# Altium schematic sheet Alcohol Detectie.SchDoc
size A4; SheetNumber: 1; SheetTotal: 1
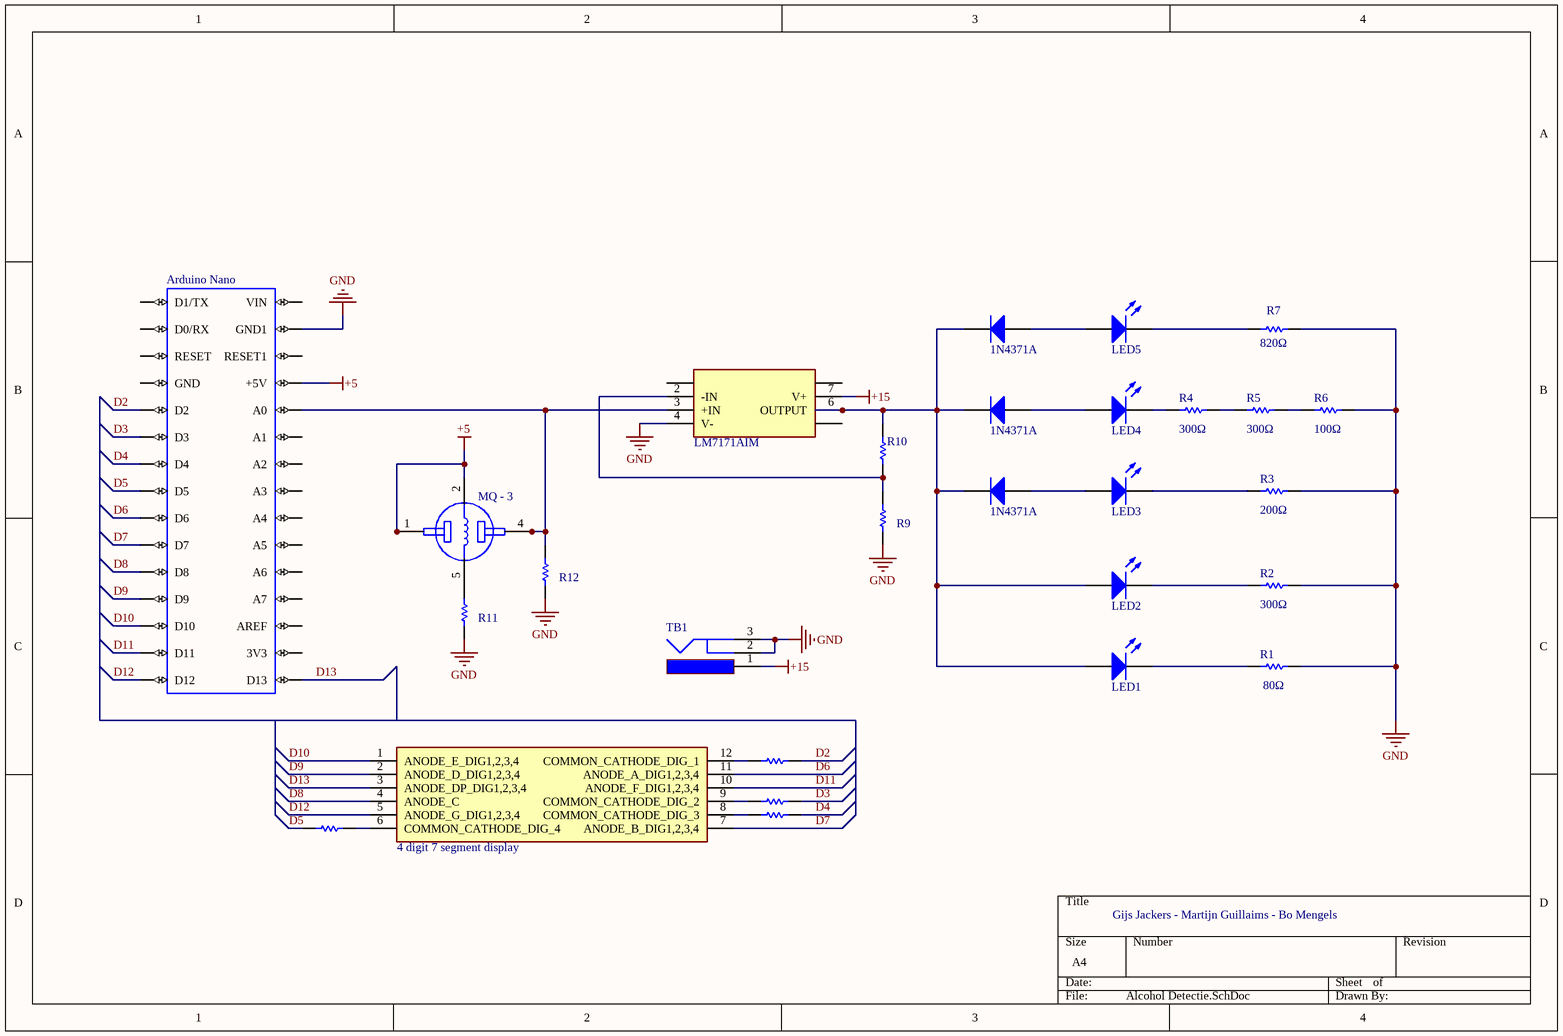
[diagram p0: Alcohol Detectie.SchDoc]

## Parts
4_digit_7_segment_display  CC56-12SRWA  [CC5612SRWA]  (value not drawn)
Arduino_Nano  ARDUINONANO  [PDIP-32]  (value not drawn)
COMPERATOR  LM7171AIM  [SOIC127P600X175-8N]
D1  1N4371A  [DO-35]
D2  1N4371A  [DO-35]
D3  1N4371A  [DO-35]
GROEN  LED1  [LED-1]
MQ_-_3  SEN-08880  [XDCR_SEN-08880]  (value not drawn)
ORANJE_1  LED2  [LED-1]
ORANJE_2  LED3  [LED-1]
R1  80Ω  [RESC2013X50X30LL20T20]
R2  300Ω  [RESC2013X50X30LL20T20]
R3  200Ω  [RESC2013X50X30LL20T20]
R4  300Ω  [RESC2013X50X30LL20T20]
R5  300Ω  [RESC2013X50X30LL20T20]
R6  100Ω  [RESC2013X50X30LL20T20]
R7  820Ω  [RESC2013X50X30LL20T20]
R9  1k Ω  [RESC2013X50X30LL20T20]  (value not drawn)
R10  1k Ω  [RESC2013X50X30LL20T20]  (value not drawn)
R11  5,1 Ω  [RESC2013X50X30LL20T20]  (value not drawn)
R12  1k Ω  [RESC2013X50X30LL20T20]  (value not drawn)
R13  330 Ω  [RESC2013X50X30LL20T20]  (value not drawn)
R14  330 Ω  [RESC2013X50X30LL20T20]  (value not drawn)
R15  330 Ω  [RESC2013X50X30LL20T20]  (value not drawn)
R16  330 Ω  [RESC2013X50X30LL20T20]  (value not drawn)
ROOD_1  LED4  [LED-1]
ROOD_2  LED5  [LED-1]
TB1  Component_1  [MJ-180PH]  (value not drawn)

## Nets
+5: Arduino_Nano.+5V MQ_-_3.1(A) MQ_-_3.2(H1) MQ_-_3.3(A)
+15: COMPERATOR.7(V+) TB1.1
GND: Arduino_Nano.GND1 COMPERATOR.4(V-) R1.2 R2.2 R3.2 R6.2 R7.2 R9.1 R11.1 R12.1 TB1.2 TB1.3
D2: Arduino_Nano.D2 R14.1
D3: Arduino_Nano.D3 R15.1
D4: Arduino_Nano.D4 R16.1
D5: Arduino_Nano.D5 R13.2
D6: 4_digit_7_segment_display.11(ANODE_A_DIG1,2,3,4) Arduino_Nano.D6
D7: 4_digit_7_segment_display.7(ANODE_B_DIG1,2,3,4) Arduino_Nano.D7
D8: 4_digit_7_segment_display.4(ANODE_C) Arduino_Nano.D8
D9: 4_digit_7_segment_display.2(ANODE_D_DIG1,2,3,4) Arduino_Nano.D9
D10: 4_digit_7_segment_display.1(ANODE_E_DIG1,2,3,4) Arduino_Nano.D10
D11: 4_digit_7_segment_display.10(ANODE_F_DIG1,2,3,4) Arduino_Nano.D11
D12: 4_digit_7_segment_display.5(ANODE_G_DIG1,2,3,4) Arduino_Nano.D12
D13: 4_digit_7_segment_display.3(ANODE_DP_DIG1,2,3,4) Arduino_Nano.D13
Net4_digit_7_segment_display_6: 4_digit_7_segment_display.6(COMMON_CATHODE_DIG_4) R13.1
Net4_digit_7_segment_display_8: 4_digit_7_segment_display.8(COMMON_CATHODE_DIG_3) R16.2
Net4_digit_7_segment_display_9: 4_digit_7_segment_display.9(COMMON_CATHODE_DIG_2) R15.2
Net4_digit_7_segment_display_12: 4_digit_7_segment_display.12(COMMON_CATHODE_DIG_1) R14.2
NetArduino_Nano_A0: Arduino_Nano.A0 COMPERATOR.3(+IN) MQ_-_3.4(B) MQ_-_3.6(B) R12.2
NetCOMPERATOR_2: COMPERATOR.2(-IN) R9.2 R10.1
NetCOMPERATOR_6: COMPERATOR.6(OUTPUT) D1.2(K) D2.2(K) D3.2(K) GROEN.1(A) ORANJE_1.1(A) R10.2
NetD1_1: D1.1(A) ORANJE_2.1(A)
NetD2_1: D2.1(A) ROOD_1.1(A)
NetD3_1: D3.1(A) ROOD_2.1(A)
NetGROEN_2: GROEN.2(K) R1.1
NetMQ_-_3_5: MQ_-_3.5(H2) R11.2
NetORANJE_1_2: ORANJE_1.2(K) R2.1
NetORANJE_2_2: ORANJE_2.2(K) R3.1
NetR4_1: R4.1 ROOD_1.2(K)
NetR4_2: R4.2 R5.1
NetR5_2: R5.2 R6.1
NetR7_1: R7.1 ROOD_2.2(K)

Not connected (* = marked no-connect by the designer): Arduino_Nano 3V3 A1 A2 A3 A4 A5 A6 A7 AREF D0/RX D1/TX GND RESET RESET1 VIN; COMPERATOR 1(N/C_1) 5(N/C_2) 8(N/C_3)

## Notes on the sheet
- Gijs Jackers - Martijn Guillaims - Bo Mengels

## Library data of the parts
4_digit_7_segment_display = CC56-12SRWA: Display; Manufacturer_Name: Kingbright; Datasheet Link: https://componentsearchengine.com//CC56-12SRWA.pdf; Height: 8.35mm; Mouser2 Part Number: 604-CC56-12SRWA; Mouser2 Price/Stock: https://www.mouser.com/Search/Refine.aspx?Keyword=604-CC56-12SRWA; Manufacturer_Part_Number: CC56-12SRWA
Arduino_Nano = ARDUINONANO: Arduino; 20MHz; 3.3Ã·5VDC; Flash: 32kB; SRAM: 2kB; ATMEGA328,FT232R; Package: None; MP: ARDUINONANO; MF: Arduino; SnapEDA_Link: https://www.snapeda.com/parts/ARDUINONANO/Arduino/view-part/7459719/?ref=snap; Check_prices: https://www.snapeda.com/parts/ARDUINONANO/Arduino/view-part/7459719/?ref=eda; Price: None; Value: *; Availability: Not in stock
COMPERATOR = LM7171AIMX_NOPB: Integrated Circuit; Manufacturer_Name: Texas Instruments; Manufacturer_Part_Number: LM7171AIMX/NOPB; Datasheet Link: http://www.ti.com/lit/gpn/LM7171; Height: 1.75mm; Mouser2 Part Number: 926-LM7171AIMX/NOPB; Mouser2 Price/Stock: https://www.mouser.com/Search/Refine.aspx?Keyword=926-LM7171AIMX%2FNOPB
D1-D3 = Diode 1N4148: High Conductance Fast Diode; Published: 8-Jun-2000; LatestRevisionDate: 17-Jul-2002; LatestRevisionNote: Re-released for DXP Platform.; DatasheetVersion: 1997; PackageReference: DO-35; Publisher: Altium Limited; PackageDescription: Diode, Axial; Body 3.8 x 1.9 mm (LxDia. max), Lead Dia. 0.53 mm (max); Code_JEDEC: DO-204-AH; ComponentLink1Description: Manufacturer Link; ComponentLink1URL: http://www.fairchildsemi.com/; ComponentLink2Description: Datasheet; ComponentLink2URL: http://www.fairchildsemi.com/ds/1N%2F1N4148.pdf
GROEN ORANJE_1 ORANJE_2 ROOD_1 ROOD_2 = LED1: Typical RED GaAs LED; Published: 8-Jun-2000; LatestRevisionDate: 08-Jul-2005; LatestRevisionNote: Mech Layer 1 removed.; PackageReference: LED-1; Publisher: Altium Limited; PackageDescription: LED; 2 Leads
MQ_-_3 = SEN-08880: Alcohol _C2H6O_ Sensor 0 V ~ 3.3 V; MF: SparkFun Electronics; Availability: Unavailable; Package: None; Price: None; SnapEDA_Link: https://www.snapeda.com/parts/SEN-08880/SparkFun%20Electronics/view-part/1160647/?ref=snap; Value: *; MP: SEN-08880
R1-R7 R9-R16 = CMP-2001-04896-1: Manufacturer: Vishay Dale; Part Number: CRCW08050000Z0EA